# EAGLE design bob-power-board (EAGLE 7.0.0)
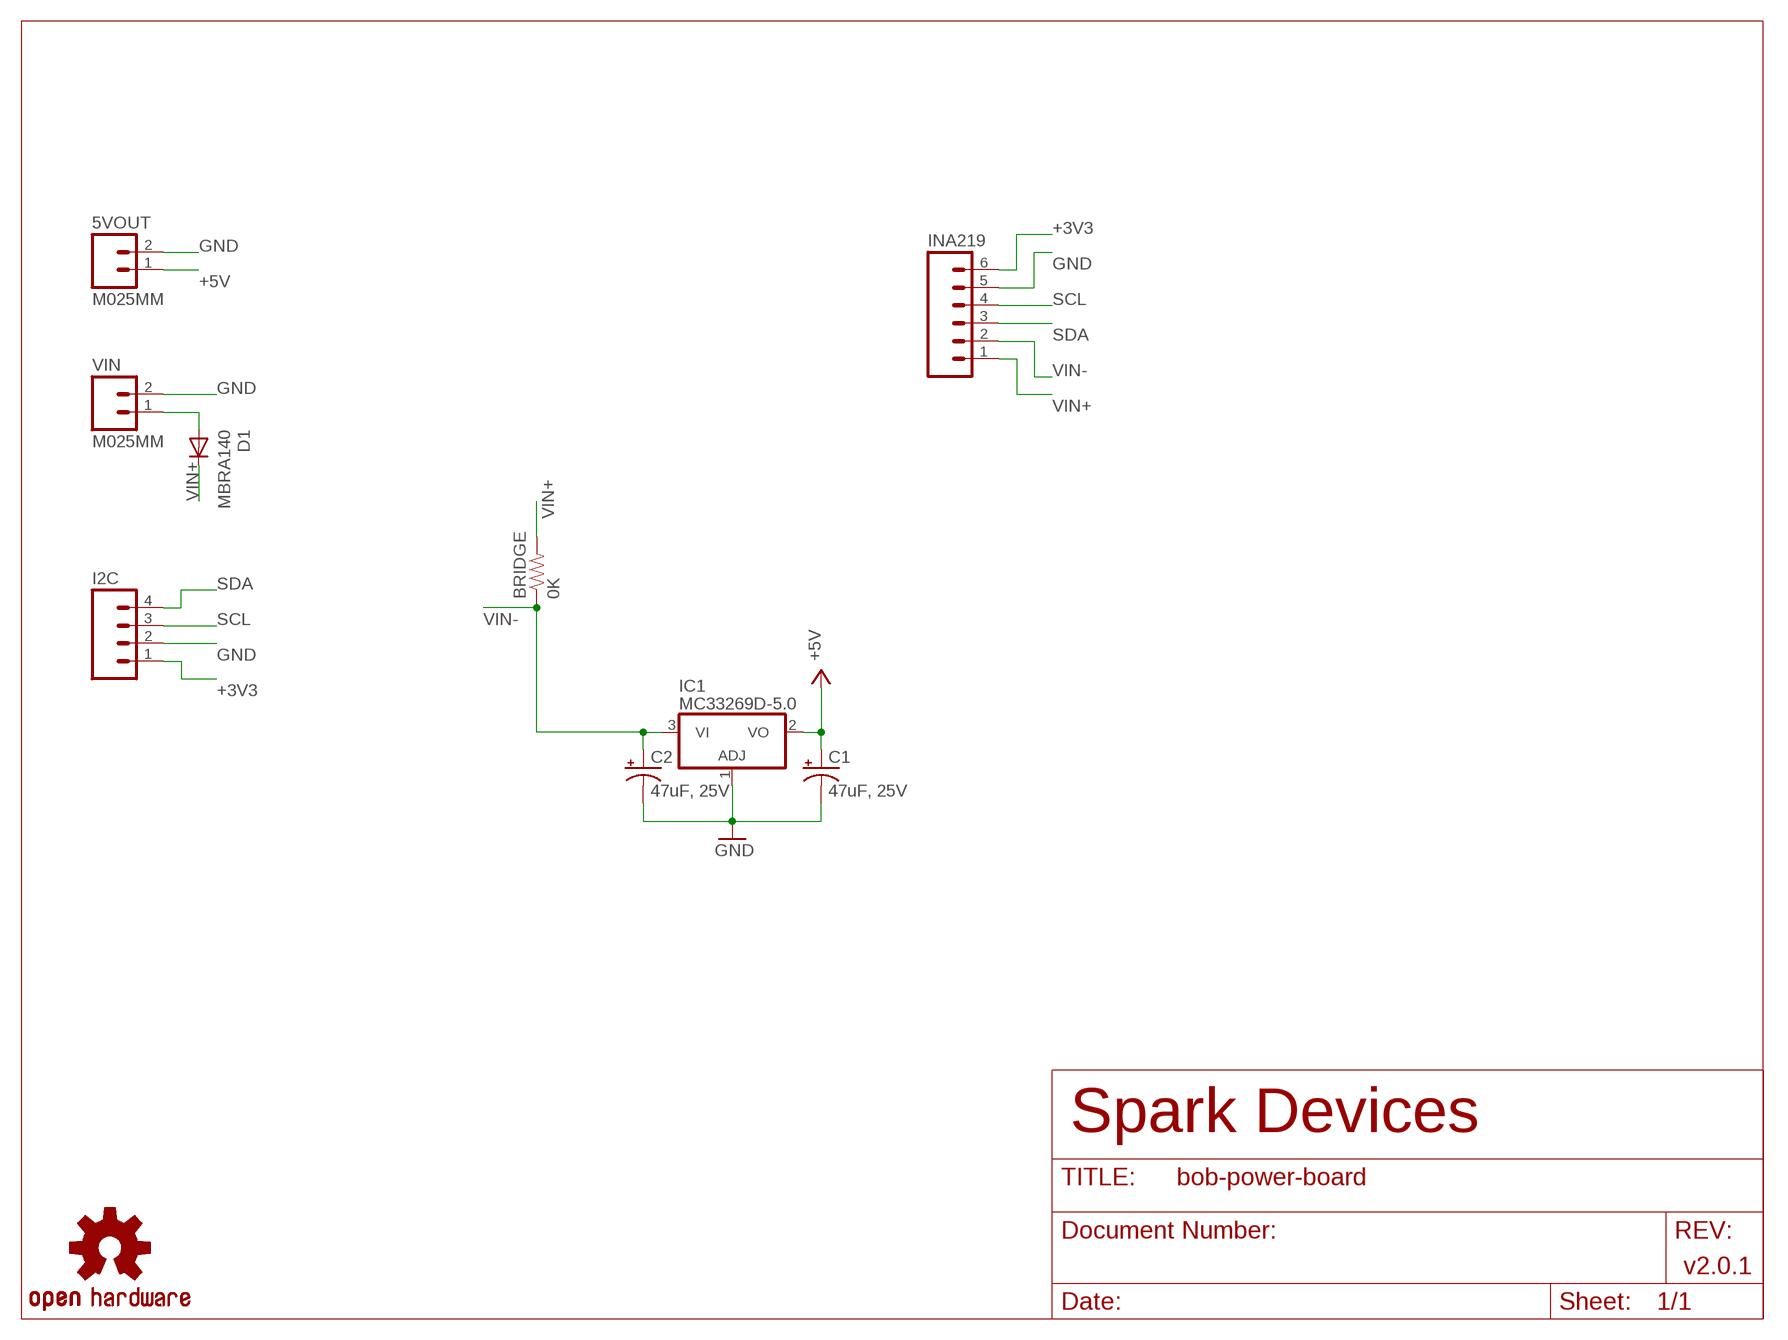
[diagram p0: schematic, sheet 1]

## Parts
5VOUT  M025MM  [SCREWTERMINAL-5MM-2]
BRIDGE  0K  RESISTOR1206  [1206]
C1  47uF, 25V  CAP_POLPTH1  [CPOL-RADIAL-100UF-25V]
C2  47uF, 25V  CAP_POLPTH1  [CPOL-RADIAL-100UF-25V]
D1  MBRA140  DIODESMA  [SMA-DIODE]
I2C  M04LOCK  [1X04_LOCK]
IC1  MC33269D-5.0  [DPACK]
INA219  M06LOCK  [1X06_LOCK]
LOGO1  OSHW-LOGOM  [OSHW-LOGO-M]
VIN  M025MM  [SCREWTERMINAL-5MM-2]

## Nets
+3V3: I2C.1 INA219.6
+5V: 5VOUT.1 C1.1(+) IC1.2(VO)
GND: 5VOUT.2 C1.2(-) C2.2(-) I2C.2 IC1.1(ADJ) INA219.5 VIN.2
N$1: D1.A VIN.1
SCL: I2C.3 INA219.4
SDA: I2C.4 INA219.3
VIN+: BRIDGE.2 D1.C INA219.1
VIN-: BRIDGE.1 C2.1(+) IC1.3(VI) INA219.2

## Notes on the sheet
- Spark Devices
- v2.0.1

## Library data of the parts
5VOUT VIN = SparkFun-Connectors:M02: Standard 2-pin 0.1" header. Use with - straight break away headers ( PRT-00116) - right angle break away headers (PRT-00553) - swiss pins (PRT-00743) - machine pins (PRT-00117) - female headers (PRT-00115) Molex polarized connector foot print use with: PRT-08233 with associated crimp pins and housings. 2.54_SCREWTERM for use with PRT-10571. 3.5mm Screw Terminal footprints for PRT-08084 5mm Screw Terminal footprints for use with PRT-08433
BRIDGE = SparkFun-Resistors:RESISTOR: Resistor Basic schematic elements and footprints for 0603, 1206, and PTH resistors.
C1 C2 = SparkFun-Capacitors:CAP_POL: Capacitor Polarized These are standard SMD and PTH capacitors. Normally 10uF, 47uF, and 100uF in electrolytic and tantalum varieties. Always verify the external diameter of the through hole cap, it varies with capacity, voltage, and manufacturer. The EIA devices should be standard.
D1 = SparkFun-DiscreteSemi:DIODE: Diode These are standard reverse protection diodes and small signal diodes. SMA package can handle up to about 1A. SOD-323 can handle about 200mA. What the SOD-323 package when ordering, there are some mfgs out there that are 5-pin packages.
I2C = SparkFun-Connectors:M04: Header 4 Standard 4-pin 0.1" header. Use with straight break away headers (SKU : PRT-00116), right angle break away headers (PRT-00553), swiss pins (PRT-00743), machine pins (PRT-00117), and female headers (PRT-00115). Molex polarized connector foot print use with SKU : PRT-08231 with associated crimp pins and housings. 1MM SMD Version SKU: PRT-10208
IC1 = linear:MC33269?*: Adjustable Output Low Dropout Voltage Regulator 800 mA Source: http://www.onsemi.com/pub/Collateral/MC33269-D.PDF
INA219 = SparkFun-Connectors:M06: Header 6 Standard 6-pin 0.1" header. Use with straight break away headers (SKU : PRT-00116), right angle break away headers (PRT-00553), swiss pins (PRT-00743), machine pins (PRT-00117), and female headers (PRT-00115). Molex polarized connector foot print use with SKU : PRT-08094 with associated crimp pins and housings. NOTES ON THE VARIANTS LOCK and LOCK_LONGPADS... This footprint was designed to help hold the alignment of a through-hole component (i.e. 6-pin header) while soldering it into place. You may notice that each hole has been shifted either up or down by 0.005 of an inch from it's more standard position (which is a perfectly straight line). This slight alteration caused the pins (the squares in the middle) to touch the edges of the holes. Because they are alternating, it causes a "brace" to hold the component in place. 0.005 has proven to be the perfect amount of "off-center" position when using our standard breakaway headers. Although looks a little odd when you look at the bare footprint, once you have a header in there, the alteration is very hard to notice. Also,if you push a header all the way into place, it is covered up entirely on the bottom side. This idea of altering the position of holes to aid alignment will be further integrated into the Sparkfun Library for other footprints. It can help hold any component with 3 or more connection pins.
LOGO1 = Spark:OSHW-LOGO: Open Source Hardware Logo This logo indicates the piece of hardware it is found on incorporates a OSHW license and/or adheres to the definition of open source hardware found here: http://freedomdefined.org/OSHW

## Net classes
0 default: width 0.152 mm, drill 0.305 mm, clearance 0.152 mm

## Board
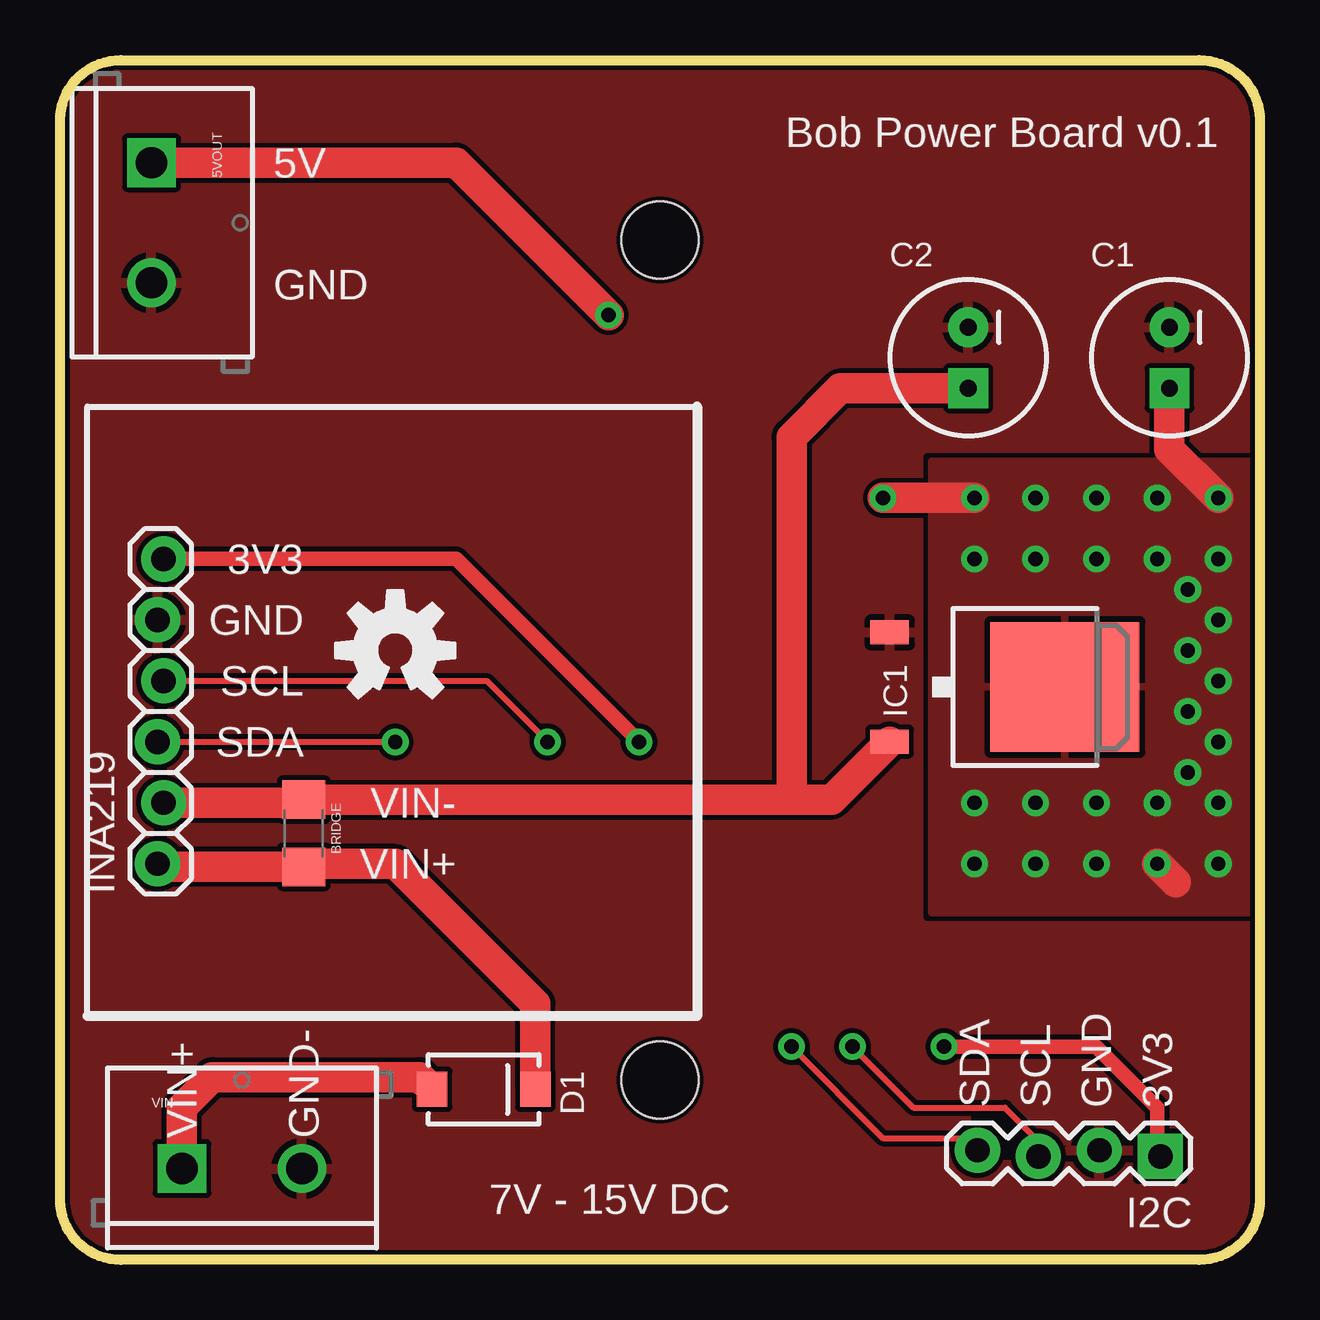
[diagram p1: board, top side]
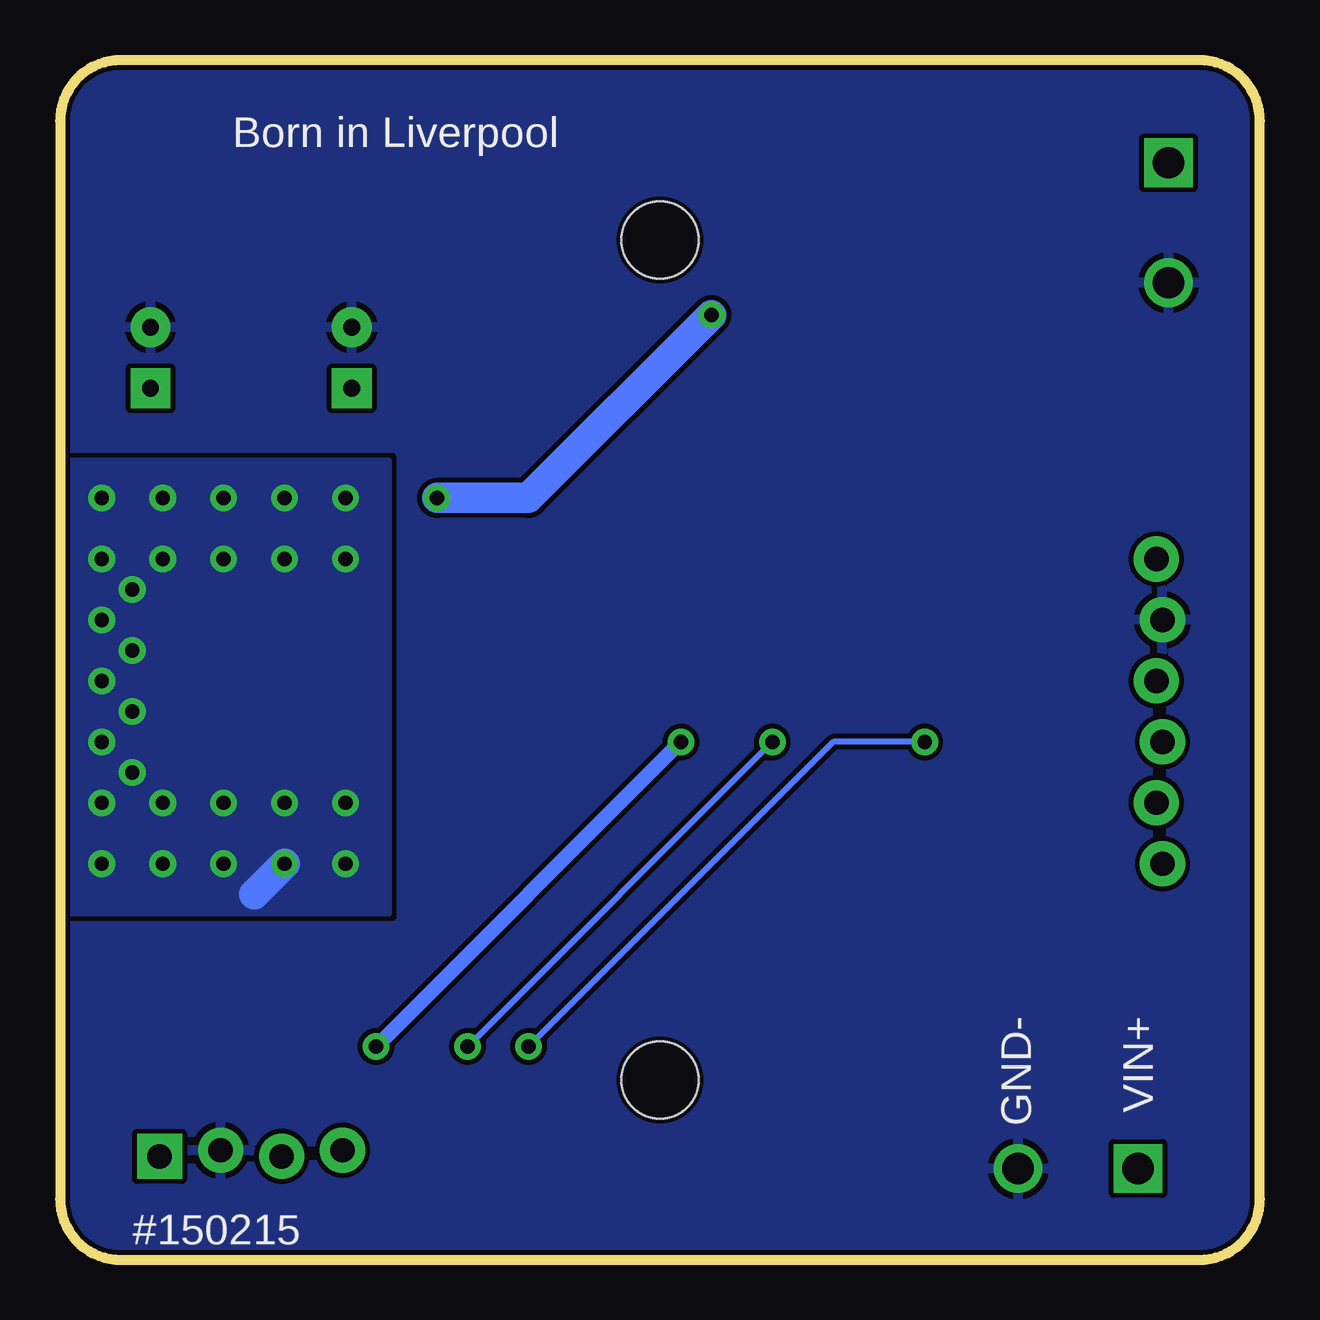
[diagram p2: board, bottom side, seen from below]

Size 50 x 50 mm. Coordinates in mm from the lower left corner, seen from the top.
Outline: 2.54,50 47.46,50 arc-90 50,47.46 50,2.54 arc-90 47.46,0 2.54,0 arc-90 0,2.54 0,47.46 arc-90 2.54,50
Copper layers (1*16): Top 0.035mm / dielectric 1.5mm / Bottom 0.035mm
Design rules "SparkFun-2-layer": minimum track width 7mil, minimum drill 15mil, track to track 8mil, track to pad 8mil, pad to pad 8mil, via to via 8mil, smd to smd 8mil, copper to edge 8mil, drill to drill 8mil, minimum pad ring 12mil, minimum via ring 10mil, stop-mask expansion 4mil, vias tented up to drill 20mil, thermal gap 10mil
Holes 3.2 mm at 25,42.5 25,7.5
vRestrict: area 47.9,10.3 to 48.5,10.8; area 50.4,10.2 to 50.9,11

### Footprints (pad centres in the part's own frame; a part is rotated, then mirrored left to right if it is on the bottom)
SCREWTERMINAL-5MM-2 = drill 1.3 pad 2.032 square: 1 0,0 | drill 1.3 pad 2.032: 2 5,0
1206 = smd 1.6 x 1.8: 1 -1.4,0; 2 1.4,0
CPOL-RADIAL-100UF-25V = drill 0.7 pad 1.651 square: 1 1.27,0 | drill 0.7 pad 1.651: 2 -1.27,0
SMA-DIODE = smd 1.27 x 1.47: A -2.15,0; C 2.15,0
1X04_LOCK = drill 1.016 pad 1.88 square: 1 0,0.127 | drill 1.016 pad 1.88: 2 2.54,-0.127; 3 5.08,0.127; 4 7.62,-0.127
DPACK = smd 1 x 1.6: 1 -2.28,-4.8; 3 2.28,-4.8 | smd 5.4 x 6.2: 2 0,2.5
1X06_LOCK = drill 1.016 pad 1.88: 1 0,0; 2 2.54,-0.254; 3 5.08,0; 4 7.62,-0.254; 5 10.16,0; 6 12.7,-0.254

### Placement (x,y rotation side)
5VOUT  3.81,45.72 270 top
BRIDGE  10.16,17.78 270 top
C1  46.23,37.59 270 top
C2  37.85,37.59 270 top
D1  17.65,7.11 0 top
I2C  45.85,4.45 180 top
IC1  39.37,23.88 270 top
INA219  4.06,16.51 90 top
LOGO1  13.97,25.4 0 top
VIN  5.08,3.81 0 top

### Tracks (layer width: path | path; a pad name or v marks a point on that pad's centre or on a via)
+3V3  (via drill 0.6)
  Top 0.61: INA219.6 16.51,29.21 v24.13,21.59 | I2C.1 45.72,4.45 45.72,6.35 43.18,8.89 v36.83,8.89
  Bottom 0.61: v24.13,21.59 v36.83,8.89
+5V  (via drill 0.6)
  Top 1.27: 46.48,15.75 v45.72,16.51 | C1.1 46.23,33.78 v48.26,31.75 | 5VOUT.1 16.51,45.72 v22.86,39.37 | v34.29,31.75 v38.1,31.75
  Bottom 1.27: 41.91,15.24 v40.64,16.51 | v22.86,39.37 30.48,31.75 v34.29,31.75
  other vias: 45.72,31.75 43.18,31.75 40.64,31.75 38.1,29.21 40.64,29.21 43.18,29.21 45.72,29.21 48.26,29.21 48.26,26.67 48.26,24.13 48.26,21.59 48.26,19.05 48.26,16.51 38.1,16.51 38.1,19.05 40.64,19.05 43.18,19.05 45.72,19.05 46.99,22.86 46.99,25.4 46.99,20.32 46.99,27.94 43.18,16.51
  pour Top: 50.77,33.27 50.77,14.48 36.32,14.48 36.32,33.27
  pour Bottom: 50.77,33.27 36.32,33.27 36.32,14.48 50.77,14.48
GND
  pour Top (rank 3): 0,2.54 0,47.46 arc-90 2.54,50 47.46,50 arc-90 50,47.46 50,2.54 arc-90 47.46,0 2.54,0 arc-90
  pour Bottom (rank 3): 0,2.54 0,47.46 arc-90 2.54,50 47.46,50 arc-90 50,47.46 50,2.54 arc-90 47.46,0 2.54,0 arc-90
N$1
  Top 1.27: VIN.1 5.08,6.35 6.35,7.62 14.99,7.62 D1.A
SCL  (via drill 0.6)
  Top 0.254: INA219.4 17.78,24.13 v20.32,21.59 | v33.02,8.89 35.56,6.35 39.37,6.35 40.64,5.08 40.64,4.45 I2C.3
  Bottom 0.254: v20.32,21.59 v33.02,8.89
SDA  (via drill 0.6)
  Top 0.254: INA219.3 v13.97,21.59 | v30.48,8.89 34.29,5.08 37.72,5.08 I2C.4
  Bottom 0.254: v30.48,8.89 17.78,21.59 v13.97,21.59
VIN+
  Top 1.27: D1.C 19.8,10.68 13.97,16.51 10.29,16.51 BRIDGE.2 4.19,16.38 INA219.1
VIN-
  Top 1.27: INA219.2 10.03,19.05 BRIDGE.1 30.48,19.18 | 30.48,19.18 32.15,19.18 IC1.3 | C2.1 32.51,36.32 30.48,34.29 30.48,19.18

### Text on the board
tPlace: Bob Power Board v0.1 | 5V | GND | 3V3 | GND | SCL | SDA | VIN- | VIN+ | SDA | SCL | GND | 3V3 | VIN+ | GND- | 7V - 15V DC
bPlace: Born in Liverpool | VIN+ | GND- | #150215
_tsilk: CORE | Shield I/O pin | Voltage | CORE | CORE | Shield I/O pin | Shield I/O pin | Voltage | Voltage | A0 | ADC0 | 3V3 | A1 | A0 | A0 | ADC1 | ADC0 | ADC0 | 3V3 | 3V3 | 3V3 | A1 | ADC1 | 3V3 | A2 | A1 | IO10/SS | ADC1 | 5V | 3V3 | A3 | A2 | A2 | IO13/SCK | IO10/SS | IO10/SS | 5V | 5V | 5V | A3 | IO13/SCK | 5V | A4 | A3 | IO12/MISO | IO13/SCK | 5V | 5V | A5 | A4 | A4 | IO11/MOSI | IO12/MISO | IO12/MISO | 5V | 5V | 5V | A5 | IO11/MOSI | 5V | A6 | A5 | ADC2 | IO11/MOSI | 3V3 | 5V | A7 | A6 | A6 | IO6/PWM | ADC2 | ADC2 | 5V | 3V3 | 3V3 | D0 | A7 | A7 | IO3/PWM | IO6/PWM | IO6/PWM | 5V | 5V | 5V | D0 | D0 | IO3/PWM | IO3/PWM | 5V | 5V | D1 | IO5/PWM | 5V | D2 | D1 | D1 | IO2 | IO5/PWM | IO5/PWM | 5V | 5V | 5V | D2 | D2 | IO2 | IO2 | 5V | 5V | D3 | IO4 | 5V | D4 | D3 | D3 | IO7 | IO4 | IO4 | 5V | 5V | 5V | D4 | D4 | IO7 | IO7 | 5V | 5V | D5 | IO8 | 5V | D6 | D5 | D5 | IO9 | IO8 | IO8 | 5V | 5V | 5V | D6 | IO9 | 5V | D7 | D6 | NC | IO9 | NA | 5V | D7 | D7 | NC | NC | NA | NA | TX | TX | 5V | RX | TX | TX | RX | TX | TX | 5V | 5V | 5V | RX | RX | 5V | RX | RX | 5V | RST | RESET | AREF | RST | RST | NC | RESET | RESET | NA | AREF | AREF | NC | NC | NA | NA | NC | ADC3 | NA | NC | NC | ADC3 | ADC3 | NA | NA | NC | ADC4 | NA | NC | NC | NC | ADC5 | ADC4 | ADC4 | NA | NA | NA | NC | NC | ADC5 | ADC5 | NA | NA
214bmp: D:/SmartProjects/Snc/a4_bn_logo2.bmp